# EAGLE design Mini_DDS (EAGLE 7.7.0)
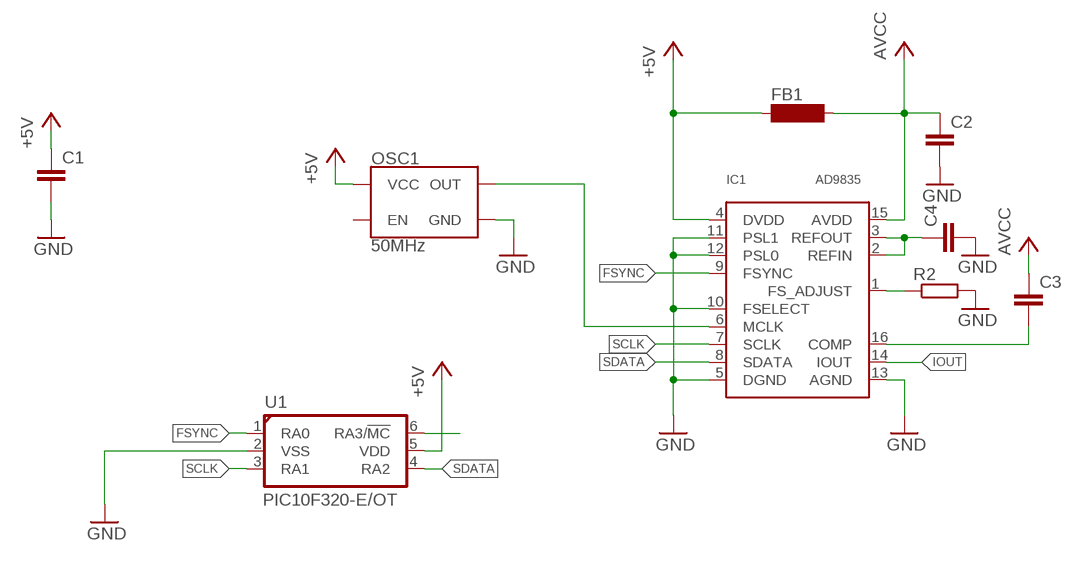
[diagram p0: schematic, sheet 1]

## Parts
C1  C-EUC0603K  [C0603K]
C2  C-EUC0603K  [C0603K]
C3  C-EUC0603K  [C0603K]
C4  C-EUC0603K  [C0603K]
FB1  SM-1206  [SM-1206]
IC1  AD9835  [TSSOP16]
OSC1  50MHz  OSCILLATORSMD-7X5-4PAD  [OSCILLATOR-SMD-7X5-4PAD]
R2  R-EU_R0603  [R0603]
U1  PIC10F320-E/OT  PIC10F320OT  [SOT23-6L]

## Nets
+5V: C1.1 FB1.1 IC1.4(DVDD) OSC1.4(VCC) U1.5(VDD)
FSYNC: IC1.9(FSYNC) U1.1(RA0)
GND: C1.2 C2.2 C4.2 IC1.5(DGND) IC1.10(FSELECT) IC1.11(PSL1) IC1.12(PSL0) IC1.13(AGND) OSC1.2(GND) R2.2 U1.2(VSS)
IOUT: IC1.14(IOUT)
N$1: IC1.1(FS_ADJUST) R2.1
N$2: C3.2 IC1.16(COMP)
N$3: C4.1 IC1.2(REFIN) IC1.3(REFOUT)
N$4: IC1.6(MCLK) OSC1.3(OUT)
N$8: U1.6(RA3/!MC!)
SCLK: IC1.7(SCLK) U1.3(RA1)
SDATA: IC1.8(SDATA) U1.4(RA2)
VCC: C2.1 C3.1 FB1.2 IC1.15(AVDD) ; supply symbol labelled AVCC
Unconnected: OSC1.1(EN)

## Library data of the parts
C1-C4 = rcl:C-EU: CAPACITOR, European symbol
FB1 = inductor-neosid:SM-1206: INDUCTOR SMD chip inductor; OC_FARNELL: unknown; OC_NEWARK: unknown
IC1 = analogdevices-dds:AD9835: CMOS Complete DDS Clock Rate up to 50 MHz Serial Interface
OSC1 = SparkFun-Clocks:OSCILLATOR: Oscillators (Generic) These are active oscillators, which require a power source to generate their clock output. Most oscillators are configured to generate a set frequency (e.g. 16MHz). They have four pins: power, ground, output, and an enable input.
R2 = rcl:R-EU_: RESISTOR, European symbol
U1 = microchip_pic10f:PIC10*F320: Low pincount microcontroller http://www.microchip.com/wwwproducts/Devices.aspx?product=PIC10F320 Properties Parameter Name Value Program Memory Type Flash Program Memory (KB) 0.448 CPU Speed (MIPS) 5 RAM Bytes 64 Capture/Compare/PWM Peripherals 2 Timers 2 x 8-bit ADC 3 ch, 8-bit Temperature Range (C) -40 to 125 Operating Voltage Range (V) 1.8 to 5.5 Pin Count 6 Cap Touch Channels 3 Features Flash Program Memory with self read/write capability Mid-range core Emulated Data EE 35 Instructions, 8 Stack Levels, hardware interrupts Low Power Internal 16 MHz / 31kHz oscillator ‘F’ Variant for wide 2.3V – 5.5V operation ‘LF’ Variant for low power 1.8V – 3.6V operation (2) stand-alone PWM’s (3) channel 8b ADC w/Vref Integrated Temperature Indicator Configurable Logic Cell (CLC) Complementary Waveform Generator (CWG) Numerically Controlled Oscillator (NCO) Two 8-bit Timer (TMR0/TMR2) Extended Watchdog Timer (EWDT) Brown-Out Reset (BOR) 25mA Source/Sink current I/O In Circuit Serial Programming (ICSP) Library from www.mikroelektroniikka.fi/lbr

## Board
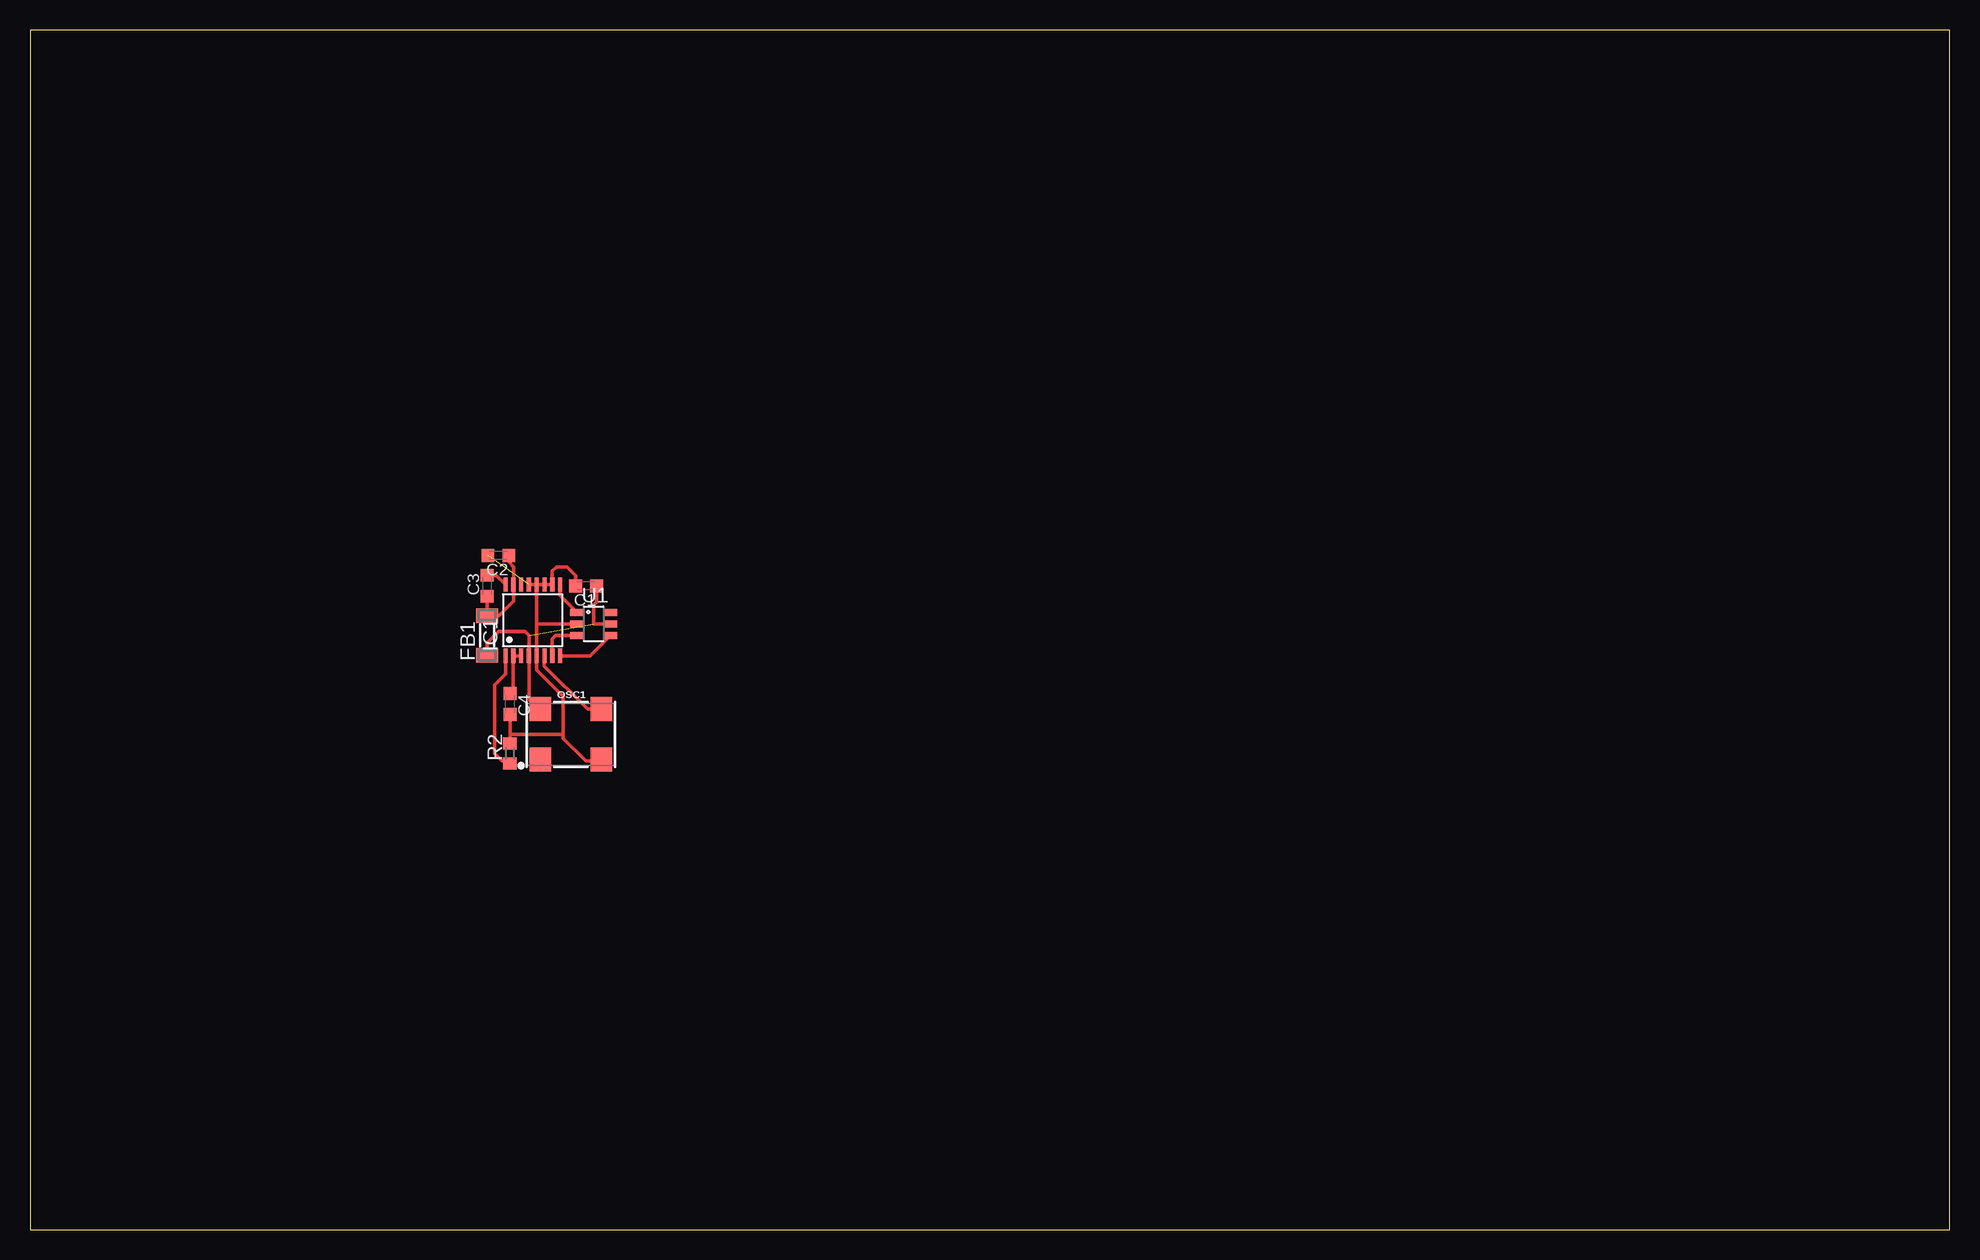
[diagram p1: board, top side]

Size 160 x 100 mm. Coordinates in mm from the lower left corner, seen from the top.
Outline: 0,0 160,0 160,100 0,100 0,0
Copper layers (1*16): Top 0.035mm / dielectric 1.5mm / Bottom 0.035mm
Design rules "default": minimum track width 10mil, minimum drill 24mil, track to track 8mil, track to pad 8mil, pad to pad 8mil, via to via 8mil, smd to smd 8mil, copper to edge 40mil, drill to drill 8mil, minimum pad ring 10mil, minimum via ring 8mil, stop-mask expansion 4mil, vias tented up to drill 0mil, thermal gap 10mil

### Footprints (pad centres in the part's own frame; a part is rotated, then mirrored left to right if it is on the bottom)
C0603K = smd 1.05 x 1.08: 1 -0.875,0; 2 0.875,0
SM-1206 = smd 1.2 x 1.8: 1 -1.65,0; 2 1.65,0
TSSOP16 = smd 0.35 x 1.2: 1 -2.275,-2.97; 2 -1.625,-2.97; 3 -0.975,-2.97; 4 -0.325,-2.97; 5 0.325,-2.97; 6 0.975,-2.97; 7 1.625,-2.97; 8 2.275,-2.97; 9 2.275,2.97; 10 1.625,2.97; 11 0.975,2.97; 12 0.325,2.97; 13 -0.325,2.97; 14 -0.975,2.97; 15 -1.625,2.97; 16 -2.275,2.97
OSCILLATOR-SMD-7X5-4PAD = smd 1.8 x 2: 1 -2.54,-2.095; 2 2.54,-2.095; 3 2.54,2.104; 4 -2.54,2.104
R0603 = smd 1 x 1.1: 1 -0.85,0; 2 0.85,0
SOT23-6L = smd 0.6 x 1.1: 1 -0.95,-1.4; 2 0,-1.4; 3 0.95,-1.4; 4 0.95,1.4; 5 0,1.4; 6 -0.95,1.4

### Placement (x,y rotation side)
C1  46.35,53.66 180 top
C2  39.05,56.2 180 top
C3  38.1,53.66 90 top
C4  40.01,43.81 270 top
FB1  38.1,49.53 90 top
IC1  41.91,50.8 0 top
OSC1  45.09,41.27 0 top
R2  40.01,39.69 90 top
U1  46.99,50.48 270 top

### Tracks (layer width: path | path; a pad name or v marks a point on that pad's centre or on a via)
+5V  (1 unrouted)
  Top 0.305: C1.1 47.23,52.31 46.99,52.07 46.99,50.48 U1.5 | OSC1.4 42.55,43.18 41.59,44.13 41.59,47.82 IC1.4 41.59,47.84 41.59,49.53 41.27,49.85 39.05,49.85 38.1,48.9 FB1.1
FSYNC
  Top 0.305: IC1.9 44.19,52.84 U1.1
GND  (1 unrouted)
  Top 0.305: IC1.13 IC1.12 | IC1.12 IC1.11 IC1.10 43.53,54.89 43.89,55.24 44.77,55.24 45.48,54.53 C1.2 | 42.23,50.48 IC1.5 42.23,46.66 44.45,44.45 44.45,41.27 | 42.23,50.48 IC1.12 | U1.2 42.23,50.48 | 44.45,41.27 44.45,40.96 46.35,39.05 47.5,39.05 OSC1.2 | 40.01,41.27 C4.2 | R2.2 40.01,41.27 | 40.01,41.27 44.45,41.27
N$1
  Top 0.305: IC1.1 39.63,46.3 38.73,45.4 38.73,39.69 39.37,39.05 39.79,39.05 R2.1
N$2
  Top 0.305: C3.2 38.87,54.53 IC1.16
N$3
  Top 0.305: IC1.3 IC1.2 40.28,44.97 C4.1
N$4
  Top 0.305: OSC1.3 46.47,43.38 42.86,46.99 42.86,47.81 IC1.6
SCLK
  Top 0.305: IC1.7 43.53,49.25 43.81,49.53 U1.3
SDATA
  Top 0.305: IC1.8 46.69,47.83 U1.4
VCC
  Top 0.305: C3.1 FB1.2 39.12,51.18 40.32,52.39 40.32,53.73 IC1.15 40.32,53.81 40.32,55.24 39.93,55.64 C2.1